# Altium project Karman Delta Arm.PrjPcb
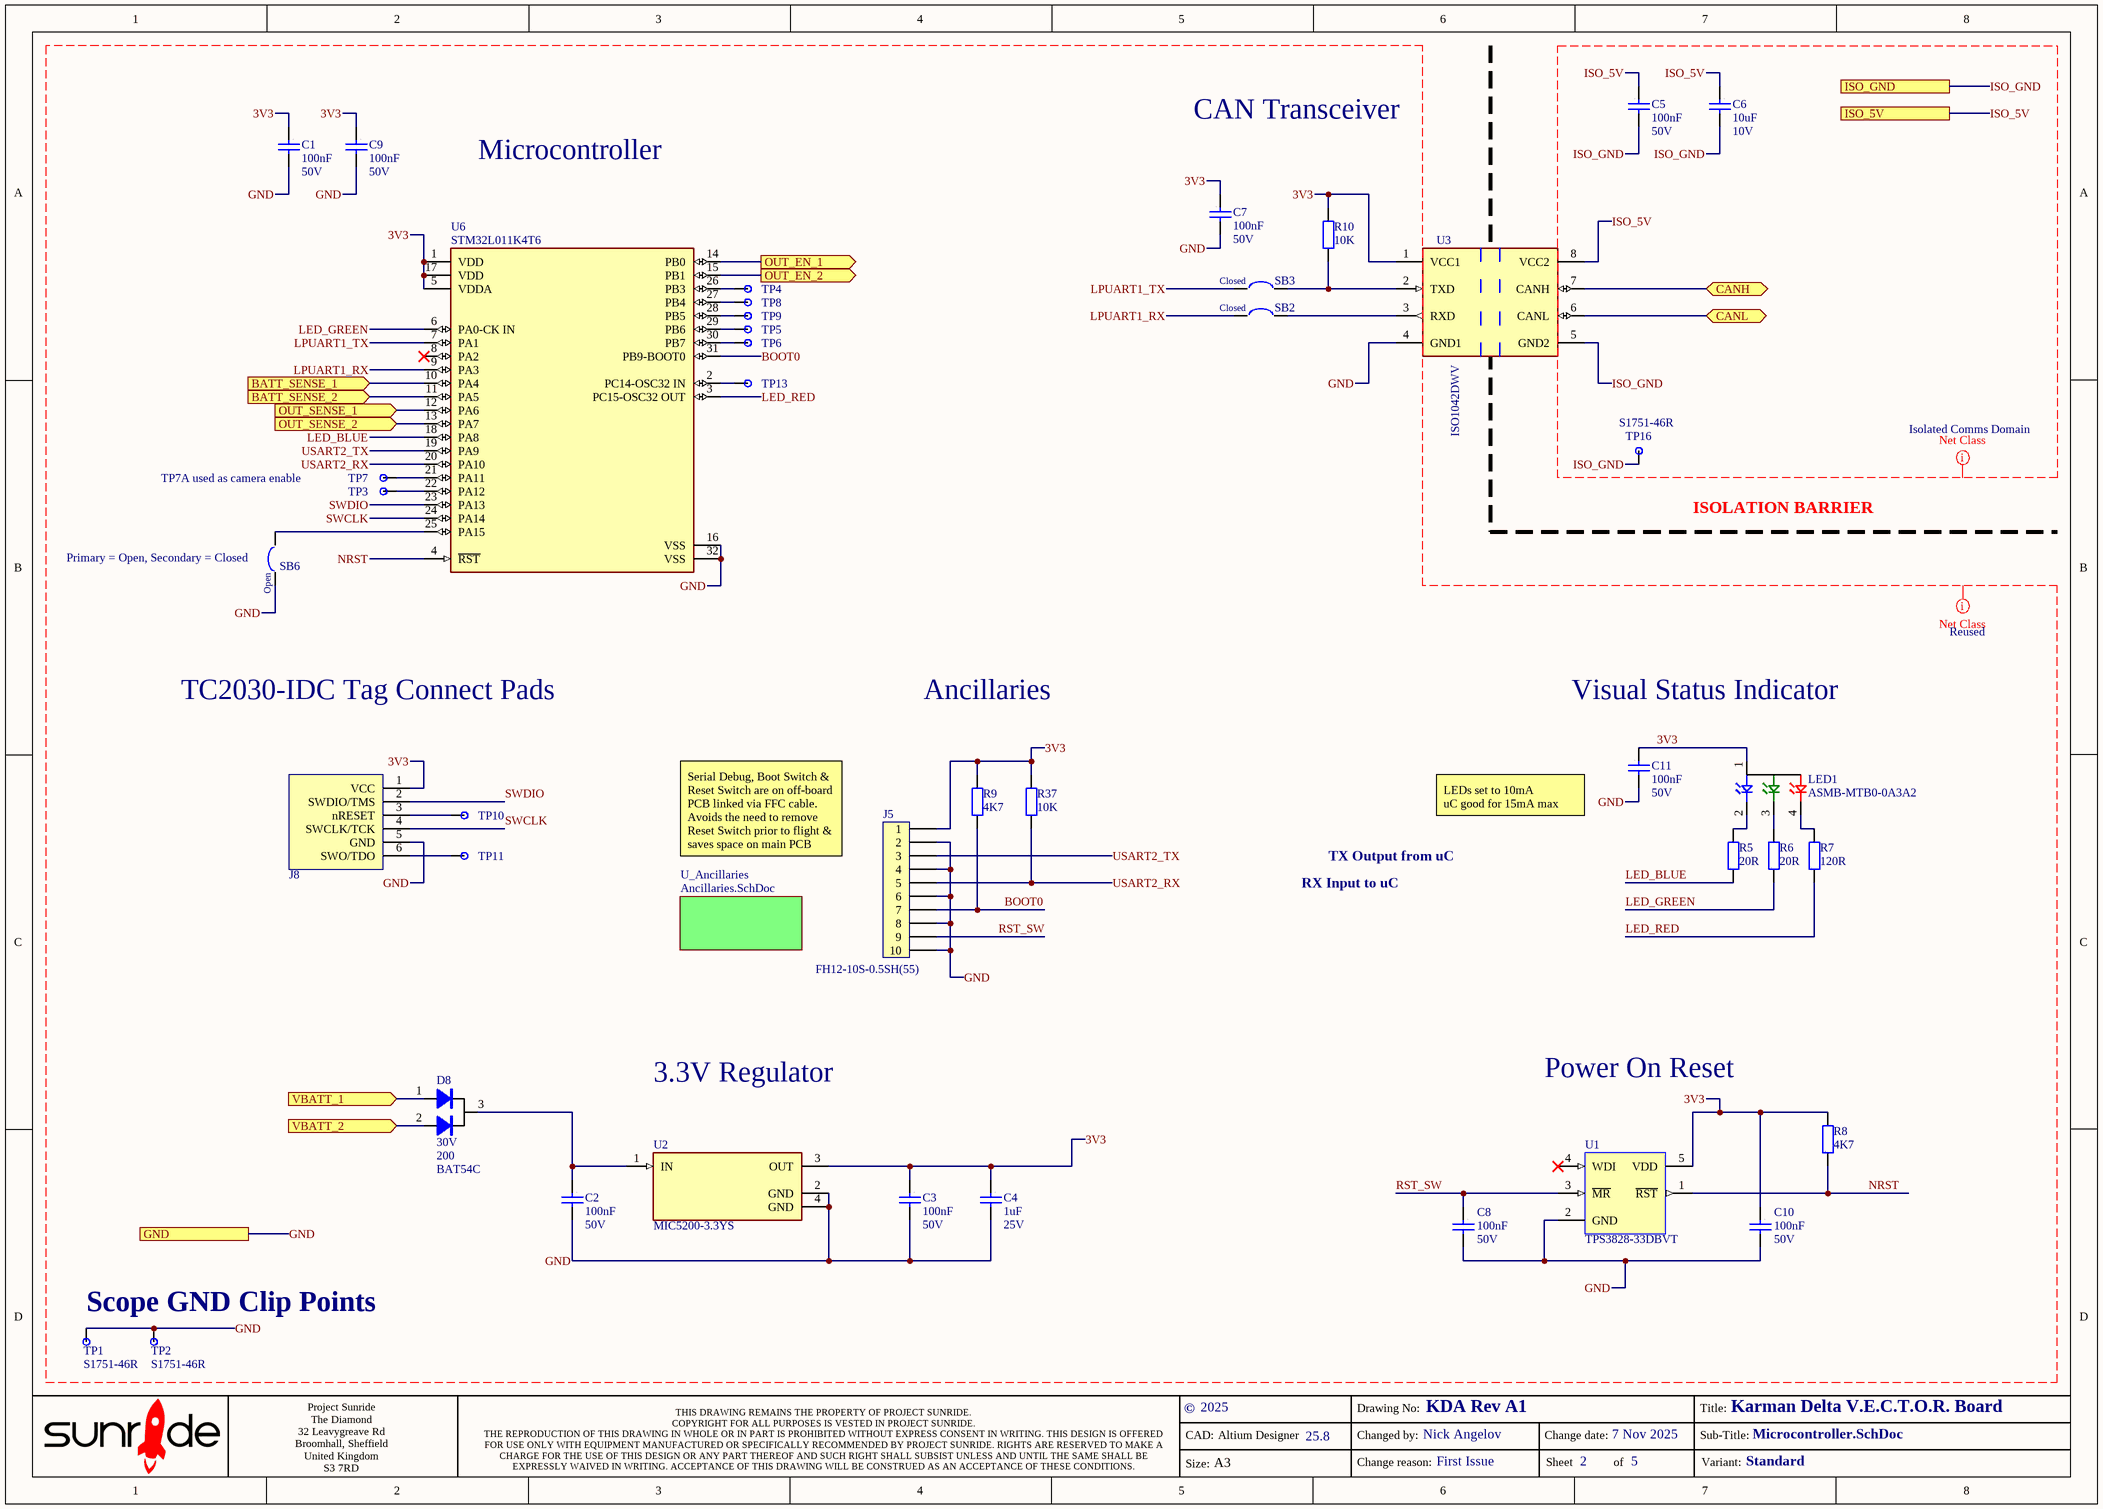
[diagram p0: Microcontroller.SchDoc]
a_AltiumVer: 25.8; a_AssemDwgNo: KDA Rev A1; a_AssemMbiNo: KDA Rev A1; a_BlockDiagramNo: -; a_BomNo: KDA Rev A1; a_CopyrightDate: 2025; a_PcbaNotesNo: -; a_PcbMbiNo: KDA Rev A1; a_PcbPartNo: KDA Rev A; a_PcbRevAuthor: Nick Angelov; a_PcbRevDate: 7 Nov 2025; a_PcbRevReason: ******; a_ReworkInstructionsNo: -; a_SchDwgNo: KDA Rev A1; a_SchRevAuthor: Nick Angelov; a_SchRevDate: 7 Nov 2025; a_SchRevReason: First Issue; a_SolderPasteStencilNo: -; a_TestSpecNo: -; a_Title: Karman Delta V.E.C.T.O.R. Board; a_Variant: Standard
1 sheet, 42 parts. Net scope: flat (ports and power ports of the same name join across sheets).
Board files: Circular PCB - Radial.PcbDoc, PCB.PcbDoc, PCB - Rectangular.PcbDoc, PCB - Rectangular Longer.PcbDoc

## Sheet Microcontroller.SchDoc
size A3; SheetNumber: 2; SheetTotal: 5

### Parts
C1  value 100nF  Voltage: 50V  [CAPC1608X08L]  (hidden comment: *)
C2  value 100nF  Voltage: 50V  [CAPC1608X08L]  (hidden comment: *)
C3  value 100nF  Voltage: 50V  [CAPC1608X08L]  (hidden comment: *)
C4  value 1uF  Voltage: 25V  [CAPC1608X08L]  (hidden comment: *)
C5  value 100nF  Voltage: 50V  [CAPC1608X08L]  (hidden comment: *)
C6  value 10uF  Voltage: 10V  [CAPC2012X15M]  (hidden comment: *)
C7  value 100nF  Voltage: 50V  [CAPC1608X08L]  (hidden comment: *)
C8  value 100nF  Voltage: 50V  [CAPC1608X08L]  (hidden comment: *)
C9  value 100nF  Voltage: 50V  [CAPC1608X08L]  (hidden comment: *)
C10  value 100nF  Voltage: 50V  [CAPC1608X08L]  (hidden comment: *)
C11  value 100nF  Voltage: 50V  [CAPC1608X08L]  (hidden comment: *)
D8  Vr (V): 30V  If (mA): 200  ManuPartNo: BAT54C  [SOT95P237X112-3M]  (hidden comment: *)
J5  Ancillaries  ManuPartNo: FH12-10S-0.5SH(55)  [FH12-10S-0_5SH]
J8  TC2030-IDC Tag Connect Pads  [TC2030-IDC-NL]  (no BOM)
LED1  Visual Status Indicator  [ASMB-MTB0-0A3A2]
R5  value 20R  [RESC1608X06L]  (hidden comment: *)
R6  value 20R  [RESC1608X06L]  (hidden comment: *)
R7  value 120R  [RESC1608X06L]  (hidden comment: *)
R8  value 4K7  [RESC1608X06L]  (hidden comment: RESISTOR)
R9  value 4K7  [RESC1608X06L]  (hidden comment: RESISTOR)
R10  value 10K  [RESC1608X06L]  (hidden comment: RESISTOR)
R37  value 10K  [RESC1608X06L]  (hidden comment: RESISTOR)
SB2  Solder Blob Closed  [0603SolderLinkClosed]  (value not drawn)  (no BOM)
SB3  Solder Blob Closed  [0603SolderLinkClosed]  (value not drawn)  (no BOM)
SB6  Primary = Open, Secondary = Closed  [0603SolderLinkOpen]  (no BOM)
TP1  GND  [S1751-46R]  (value not drawn)
TP2  GND  [S1751-46R]  (value not drawn)
TP3  TMS  [TP1]  (value not drawn)  (no BOM)
TP4  TMS  [TP1]  (value not drawn)  (no BOM)
TP5  TMS  [TP1]  (value not drawn)  (no BOM)
TP6  TMS  [TP1]  (value not drawn)  (no BOM)
TP7  TP7A used as camera enable  [TP1]  (no BOM)
TP8  TMS  [TP1]  (value not drawn)  (no BOM)
TP9  TMS  [TP1]  (value not drawn)  (no BOM)
TP10  TMS  [TP1]  (value not drawn)  (no BOM)
TP11  TMS  [TP1]  (value not drawn)  (no BOM)
TP13  TMS  [TP1]  (value not drawn)  (no BOM)
TP16  GND  [S1751-46R]  (value not drawn)
U1  Power On Reset  ManuPartNo: TPS3828-33DBVT  [SOT95P280X145-5L]
U2  MIC5200-3.3YS  [FP-SOT223-3LD-PL-1-IPC_C]
U3  CAN Transceiver  Manuf Part No: ISO1042DWV  [FP-DWV0008A-IPC_C]
U6  Microcontroller  Manufacturer Part Number: STM32L011K4T6  [FP-LQFP32-5V-MFG]

### Sub-sheets
U_Ancillaries = Ancillaries.SchDoc (file not in this document): no entries

### Ports
BATT_SENSE_1 (in), BATT_SENSE_2 (in), CANH (bidir), CANL (bidir), GND, ISO_5V, ISO_GND, OUT_EN_1 (out), OUT_EN_2 (out), OUT_SENSE_1 (in), OUT_SENSE_2 (in), VBATT_1 (in), VBATT_2 (in)

### Nets
3V3: C1.1 C3.1 C4.1 C7.1 C9.1 C10.1 C11.1 J5.1 J8.1(VCC) LED1.1(A) R8.2 R9.2 R10.2 R37.2 U1.5(VDD) U2.3(OUT) U3.1(VCC1) U6.1(VDD) U6.5(VDDA) U6.17(VDD)
BATT_SENSE_1: U6.10(PA4) ; port BATT_SENSE_1
BATT_SENSE_2: U6.11(PA5) ; port BATT_SENSE_2
BOOT0: J5.7 R9.1 U6.31(PB9-BOOT0)
CANH: U3.7(CANH) ; port CANH
CANL: U3.6(CANL) ; port CANL
GND: C1.2 C2.2 C3.2 C4.2 C7.2 C8.2 C9.2 C10.2 C11.2 J5.2 J5.4 J5.6 J5.8 J5.10 J8.5(GND) SB6.1 TP1.1 TP2.1 U1.2(GND) U2.2(GND) U2.4(GND) U3.4(GND1) U6.16(VSS) U6.32(VSS) ; port GND
ISO_5V: C5.1 C6.1 U3.8(VCC2) ; port ISO_5V
ISO_GND: C5.2 C6.2 TP16.1 U3.5(GND2) ; port ISO_GND
LED_BLUE: R5.1 U6.18(PA8)
LED_GREEN: R6.1 U6.6(PA0-CK_IN)
LED_RED: R7.1 U6.3(PC15-OSC32_OUT)
LPUART1_RX: SB2.1 U6.9(PA3)
LPUART1_TX: SB3.1 U6.7(PA1)
NRST: R8.1 U1.1(~{RST}) U6.4(~{RST})
OUT_EN_1: U6.14(PB0) ; port OUT_EN_1
OUT_EN_2: U6.15(PB1) ; port OUT_EN_2
OUT_SENSE_1: U6.12(PA6) ; port OUT_SENSE_1
OUT_SENSE_2: U6.13(PA7) ; port OUT_SENSE_2
RST_SW: C8.1 J5.9 U1.3(~{MR})
SWCLK: J8.4(SWCLK/TCK) U6.24(PA14)
SWDIO: J8.2(SWDIO/TMS) U6.23(PA13)
USART2_RX: J5.5 R37.1 U6.20(PA10)
USART2_TX: J5.3 U6.19(PA9)
VBATT_1: D8.1 ; port VBATT_1
VBATT_2: D8.2 ; port VBATT_2
NetC2_1: C2.1 D8.3 U2.1(IN)
NetJ8_3: J8.3(nRESET) TP10.1
NetJ8_6: J8.6(SWO/TDO) TP11.1
NetLED1_2: LED1.2(B) R5.2
NetLED1_3: LED1.3(G) R6.2
NetLED1_4: LED1.4(R) R7.2
NetR10_1: R10.1 SB3.2 U3.2(TXD)
NetSB2_2: SB2.2 U3.3(RXD)
NetSB6_2: SB6.2 U6.25(PA15)
NetTP3_1: TP3.1 U6.22(PA12)
NetTP4_1: TP4.1 U6.26(PB3)
NetTP5_1: TP5.1 U6.29(PB6)
NetTP6_1: TP6.1 U6.30(PB7)
NetTP7_1: TP7.1 U6.21(PA11)
NetTP8_1: TP8.1 U6.27(PB4)
NetTP9_1: TP9.1 U6.28(PB5)
NetTP13_1: TP13.1 U6.2(PC14-OSC32_IN)

Not connected (* = marked no-connect by the designer): U1 4(WDI)*; U6 8(PA2)*

### Layout directives
net class Isolated Comms Domain: ISO_5V, ISO_GND
net class Reused: 3V3, BOOT0, GND, LED_BLUE, LED_GREEN, LED_RED, LPUART1_RX, LPUART1_TX, NRST, RST_SW, SWCLK, SWDIO, USART2_RX, USART2_TX

### Notes on the sheet
- ISOLATION BARRIER
- Serial Debug, Boot Switch & Reset Switch are on off-board PCB linked via FFC cable.
  Avoids the need to remove Reset Switch prior to flight & saves space on main PCB
- TX Output from uC
- LEDs set to 10mA
  uC good for 15mA max
- RX Input to uC
- 3.3V Regulator
- Scope GND Clip Points
- ©
- CAD:
- Altium Designer
- Changed by:
- Drawing No:
- Change date:
- Title:
- Sub-Title:
- Project Sunride
  The Diamond
  32 Leavygreave Rd
  Broomhall, Sheffield
  United Kingdom
  S3 7RD
- THIS DRAWING REMAINS THE PROPERTY OF PROJECT SUNRIDE.
  COPYRIGHT FOR ALL PURPOSES IS VESTED IN PROJECT SUNRIDE.
  THE REPRODUCTION OF THIS DRAWING IN WHOLE OR IN PART IS PROHIBITED WITHOUT EXPRESS CONSENT IN WRITING. THIS DESIGN IS OFFERED FOR USE ONLY WITH EQUIPMENT MANUFACTURED OR SPECIFICALLY RECOMMENDED BY PROJECT SUNRIDE. RIGHTS ARE RESERVED TO MAKE A CHARGE FOR THE USE OF THIS DESIGN OR ANY PART THEREOF AND SUCH RIGHT SHALL SUBSIST UNLESS AND UNTIL THE SAME SHALL BE EXPRESSLY WAIVED IN WRITING. ACCEPTANCE OF THIS DRAWING WILL BE CONSTRUED AS AN ACCEPTANCE OF THESE CONDITIONS.
- Size:
- A3
- Change reason:
- Sheet
- of
- Variant:
- (in symbol Solder Blob Closed) Closed
- (in symbol Solder Blob Open) Open

### Library data of the parts
C1-C3 C5 C7-C11 = FEC882-0023: Capacitor MLC 100nF 50V X7R 10% CAPC1608X08M; Manufacturer: Murata; ManuPartNo: GRM188R71H104KA93D; Cost 1+: 0.064; Cost 1K+: 0.039; Life: V; Source: FEC882-0023; Dielectric: X7R; Supplier 1: Farnell; Supplier Part Number 1: 8820023; Tolerance: 10%; Class: Capacitor MLC; RoHS: Y; Created: 25/01/2013; Last_Updated: 25/01/2013
C4 = FEC3013414: Capacitor MLC 1uF 25V X7R 10% CAPC1608X08M; Manufacturer: Samsung; ManuPartNo: CL10B105KA8NFNC; Cost 1+: 0.0261; Cost 1K+: 0.0112; Life: V; Source: FEC3013414; Dielectric: X7R; Supplier 1: Farnell; Supplier Part Number 1: 3013414; Tolerance: 10%; Class: Capacitor MLC; RoHS: Y; Created: 11/05/2021; Last_Updated: 11/05/2021; ComponentLink1Description: Datasheet; ComponentLink1URL: C:\Altium SANDBOX\Component Database\Datasheet\2710598.pdf
C6 = Mouser81-GRM21BR71A106KE51: Capacitor MLC 10uF10V X7R 10% CAPC2012X15M; Manufacturer: Murata; ManuPartNo: GRM21BR71A106KE51L; Cost 1+: 0.189; Cost 1K+: 0.046; Life: V; Source: Mouser81-GRM21BR71A106KE51; Dielectric: X7R; Supplier 1: Mouser; Supplier Part Number 1: 81-GRM21BR71A106KE51; Tolerance: 10%; Class: Capacitor MLC; RoHS: Y; Created: 21/12/2016; Last_Updated: 21/12/2016
D8 = FEC146-7518: Diode Schottky BAT54C SOT-23; Manufacturer: Fairchild; Ptot (mW): 290; Cost 1+: 0.117; Cost 1K+: 0.0297; Vf: 0.8V; Life: V; Source: FEC146-7518; Supplier 1: Farnell; Supplier Part Number 1: 1467518; Class: Diode Schottky; RoHS: Y; Created: 16/12/2013; Last_Updated: 26/06/2018; ComponentLink1Description: Datasheet; ComponentLink1URL: C:\Altium SANDBOX\Component Database\Datasheet\BAT54 Fairchild.pdf
J5 = FEC1324540: Connector 10W FFC/FPC 0.5mm SM ZIF; Manufacturer: Hirose; Orient: Horizontal; Cost 1+: 1.02; Cost 1K+: 0.563; Life: V; Source: FEC1324540; Pin Count: 10; Supplier 1: Farnell; Supplier Part Number 1: 1324540; Class: Connector; RoHS: Y; Created: 28/02/2020; Last_Updated: 28/02/2020; ComponentLink1Description: Datasheet; ComponentLink1URL: C:\Altium SANDBOX\Component Database\Datasheet\Hirose FH12 Series.pdf
J8 = TC2030-IDC-NL: TC2030 Tag Connect Programmer Connection - Non BOM part; Orient: Vertical; Life: V; Source: TC2030-IDC-NL; Pin Count: 6; Manufacturer: Tag Connect; RoHS: Y; Created: 28/09/2025; Last_Updated: 28/09/2025; ComponentLink1Description: Datasheet; ComponentLink1URL: C:\Altium SANDBOX\Component Database\Datasheet\TC2030-CTX.pdf
LED1 = FEC2401105: LED RGB, SMD, 2.4mm, 115 °; Manufacturer: Wurth; IF Max (mA): 20; View Angle: 115; Cost 1+: 0.278; Cost 1K+: 0.141; Life: V; Source: FEC2401105; ManuPartNo: ASMB-MTB0-0A3A2; IF Typ (mA): 20; Supplier 1: Farnell; Supplier Part Number 1: 2401105; Class: LED; RoHS: Y; Created: 09/03/2018; Last_Updated: 09/03/2018; ComponentLink1Description: Datasheet; ComponentLink1URL: C:\Altium SANDBOX\Component Database\Datasheet\2343968.pdf
R5 R6 = FEC933-0798: Resistor 20R 1% 50V RESC1608X06M; Manufacturer: Multicomp; ManuPartNo: MC 0.063W 0603 1% 20R; Cost 1+: 0.021; Cost 1K+: 0.015; Life: V; Source: FEC933-0798; Voltage: 50V; Supplier 1: Farnell; Supplier Part Number 1: 9330798; Tolerance: 1%; Class: Resistor; RoHS: Y; Created: 23/01/2013; Last_Updated: 23/01/2013
R7 = FEC933-0496: Resistor 120R 1% 50V RESC1608X06M; Manufacturer: Multicomp; ManuPartNo: MC 0.063W 0603 1% 120R; Cost 1+: 0.021; Cost 1K+: 0.015; Life: V; Source: FEC933-0496; Voltage: 50V; Supplier 1: Farnell; Supplier Part Number 1: 9330496; Tolerance: 1%; Class: Resistor; RoHS: Y; Created: 23/01/2013; Last_Updated: 23/01/2013
R8 R9 = FEC933-1247: Resistor 4K7 1% 50V RESC1608X06M; Manufacturer: Multicomp; ManuPartNo: MC 0.063W 0603 1% 4K7; Cost 1+: 0.021; Cost 1K+: 0.015; Life: V; Source: FEC933-1247; Voltage: 50V; Supplier 1: Farnell; Supplier Part Number 1: 9331247; Tolerance: 1%; Class: Resistor; RoHS: Y; Created: 23/01/2013; Last_Updated: 23/01/2013
R10 R37 = PanasonicERA3AEB103V: SMD Chip Resistor, Thin Film, 10 kohm, 75 V, 0603 [1608 Metric], 100 mW, ± 0.1%, ERA3A Series; Voltage: 75V; Cost 1+: 0.237; Cost 1K+: 0.053; Power: 100mW; Source: PanasonicERA3AEB103V; Manufacturer: Panasonic; ManuPartNo: ERA3AEB103V; Supplier 1: Farnell; Supplier Part Number 1: 1577619; Tolerance: 0.1%; Class: Resistor; RoHS: Y; Life: V; Created: 27/02/2018; Last_Updated: 27/02/2018; ComponentLink1Description: Datasheet; ComponentLink1URL: C:\Altium SANDBOX\Component Database\Datasheet\Panasonic Resistors.pdf
SB2 SB3 = Solder Blob Closed: Solder Blob - Closed 0603 SM pads; Life: V; Source: Solder Blob Closed; Pin Count: 2; RoHS: Y; Created: 13/10/2017; Last_Updated: 13/10/2017
SB6 = Solder Blob Open: Solder Blob - Open 0603 SM pads; Life: V; Source: Solder Blob Open; Pin Count: 2; RoHS: Y; Created: 13/10/2017; Last_Updated: 13/10/2017
TP1 TP2 TP16 = FEC2293786: PCB Test Point S1751 Series, Surface Mount; Manufacturer: Harwin; Orient: Vertical; Cost 1+: 0.134; Cost 1K+: 0.106; Class: Connector; Life: V; Source: FEC2293786; ManuPartNo: S1751-46R; Pin Count: 1; Supplier 1: Farnell; Supplier Part Number 1: 2293786; RoHS: Y; Created: 16/10/2017; Last_Updated: 01/12/2017; ComponentLink1Description: Datasheet; ComponentLink1URL: C:\Altium SANDBOX\Component Database\Datasheet\S1751-46R.pdf
TP3-TP11 TP13 = Misc TP1: Testpoint 1mm dia. Component side, no silk; Source: Misc TP1; Class: Testpoint; Created: 26/01/2013; Last_Updated: 26/01/2013; Supplier 1: Misc; Supplier Part Number 1: TP1
U1 = FEC845-7255: IC Supply Voltage Monitor, 2.93V TPS3828-33DBVT SOT23-5; Manufacturer: Texas; Cost 1+: 1.08; Cost 1K+: 0.73; Class: IC Sensor; Life: V; Source: FEC845-7255; Supplier 1: Farnell; Supplier Part Number 1: 8457255; RoHS: Y; Created: 10/06/2013; Last_Updated: 10/06/2013; ComponentLink1Description: Datasheet; ComponentLink1URL: C:\Altium SANDBOX\Component Database\Datasheet\TPS3828.pdf
U2 = CMP-06324-000085-1: IC REG LIN 3.3V 100MA SOT223-3; Max Input Voltage: 26V; Output Type: Fixed; Number of Regulators: 1; Dropout Voltage: 230mV; Min Input Voltage: 2.5V; Max Operating Temperature: 125°C; Lead Free: Lead Free; Output Current: 100mA; Mount: Surface Mount; Min Current Limit: 100mA; Min Operating Temperature: -40°C; Case/Package: SOT-223; Number of Pins: 3; Packaging: Rail/Tube; Nominal Output Voltage: 3.3V; REACH SVHC: No SVHC; Output Voltage: 3.3V
U3 = CMP-04872-000132-1: IC TRANSCEIVER FULL 1/1 8SOIC; RoHS Compliant: Yes
U6 = CMP-12105-000012-1: IC MCU 32BIT 16KB FLASH 32LQFP; Manufacturer: STMicroelectronics; Number Of Adc Channels: 10; Min Supply Voltage: 1.65V; Number Of I2C Channels: 1; Data Bus Width: 32bits; Number Of Timers/Counters: 8; Standoff Height: 0.05mm; Memory Size: 16KBytes; Max Junction Temp: +105°C; Number Of I/Os: 26; Number Of Uart Channels: 2; Interface: I2C,SPI,UART,USART,IrDA; Ram Size: 2KBytes; Frequency: 32MHz; Nominal Supply Current: 500-1500uA; Max Supply Voltage: 3.6V; Core Architecture: Arm Cortex-M0+; Temperature Range Low: -40°C; Package: LQFP32-5V; Lead Free: Yes; Number Of Spi Channels: 1; Number Of A/D Converters: 1; Ambient Temperature Range Low: -40°C; Automotive: No; Category: IC; ComponentLink2URL: https://www.st.com/content/ccc/resource/technical/document/datasheet/42/c0/ab/e5/71/7a/47/0b/DM00206508.pdf/files/DM00206508.pdf/jcr:content/translations/en.DM00206508.pdf; Device Class L3: Microcontrollers; Mouser Description: ARM Microcontrollers - MCU Ultra-low-power ARM Cortex-M0+ MCU with 16-Kbytes Flash, 32 MHz CPU; Number Of Cores: 1; Device Class L2: Embedded Processors and Controllers; Height: 1.6mm; Memory Type: FLASH; Device Class L1: Integrated Circuits (ICs); Digikey Description: IC MCU 32BIT 16KB FLASH 32LQFP; RoHS: TRUE; Ipc Land Pattern Name: QFP80P900X900X160-32; Ambient Temperature Range High: +85°C; Temperature Range High: +85°C; Octopart: https://octopart.com/stm32l011k4t6-stmicroelectronics-71108062; ComponentLink2Description: Datasheet; Temperature: -40°C to +85°C